# EAGLE design plytka (EAGLE 6.3)
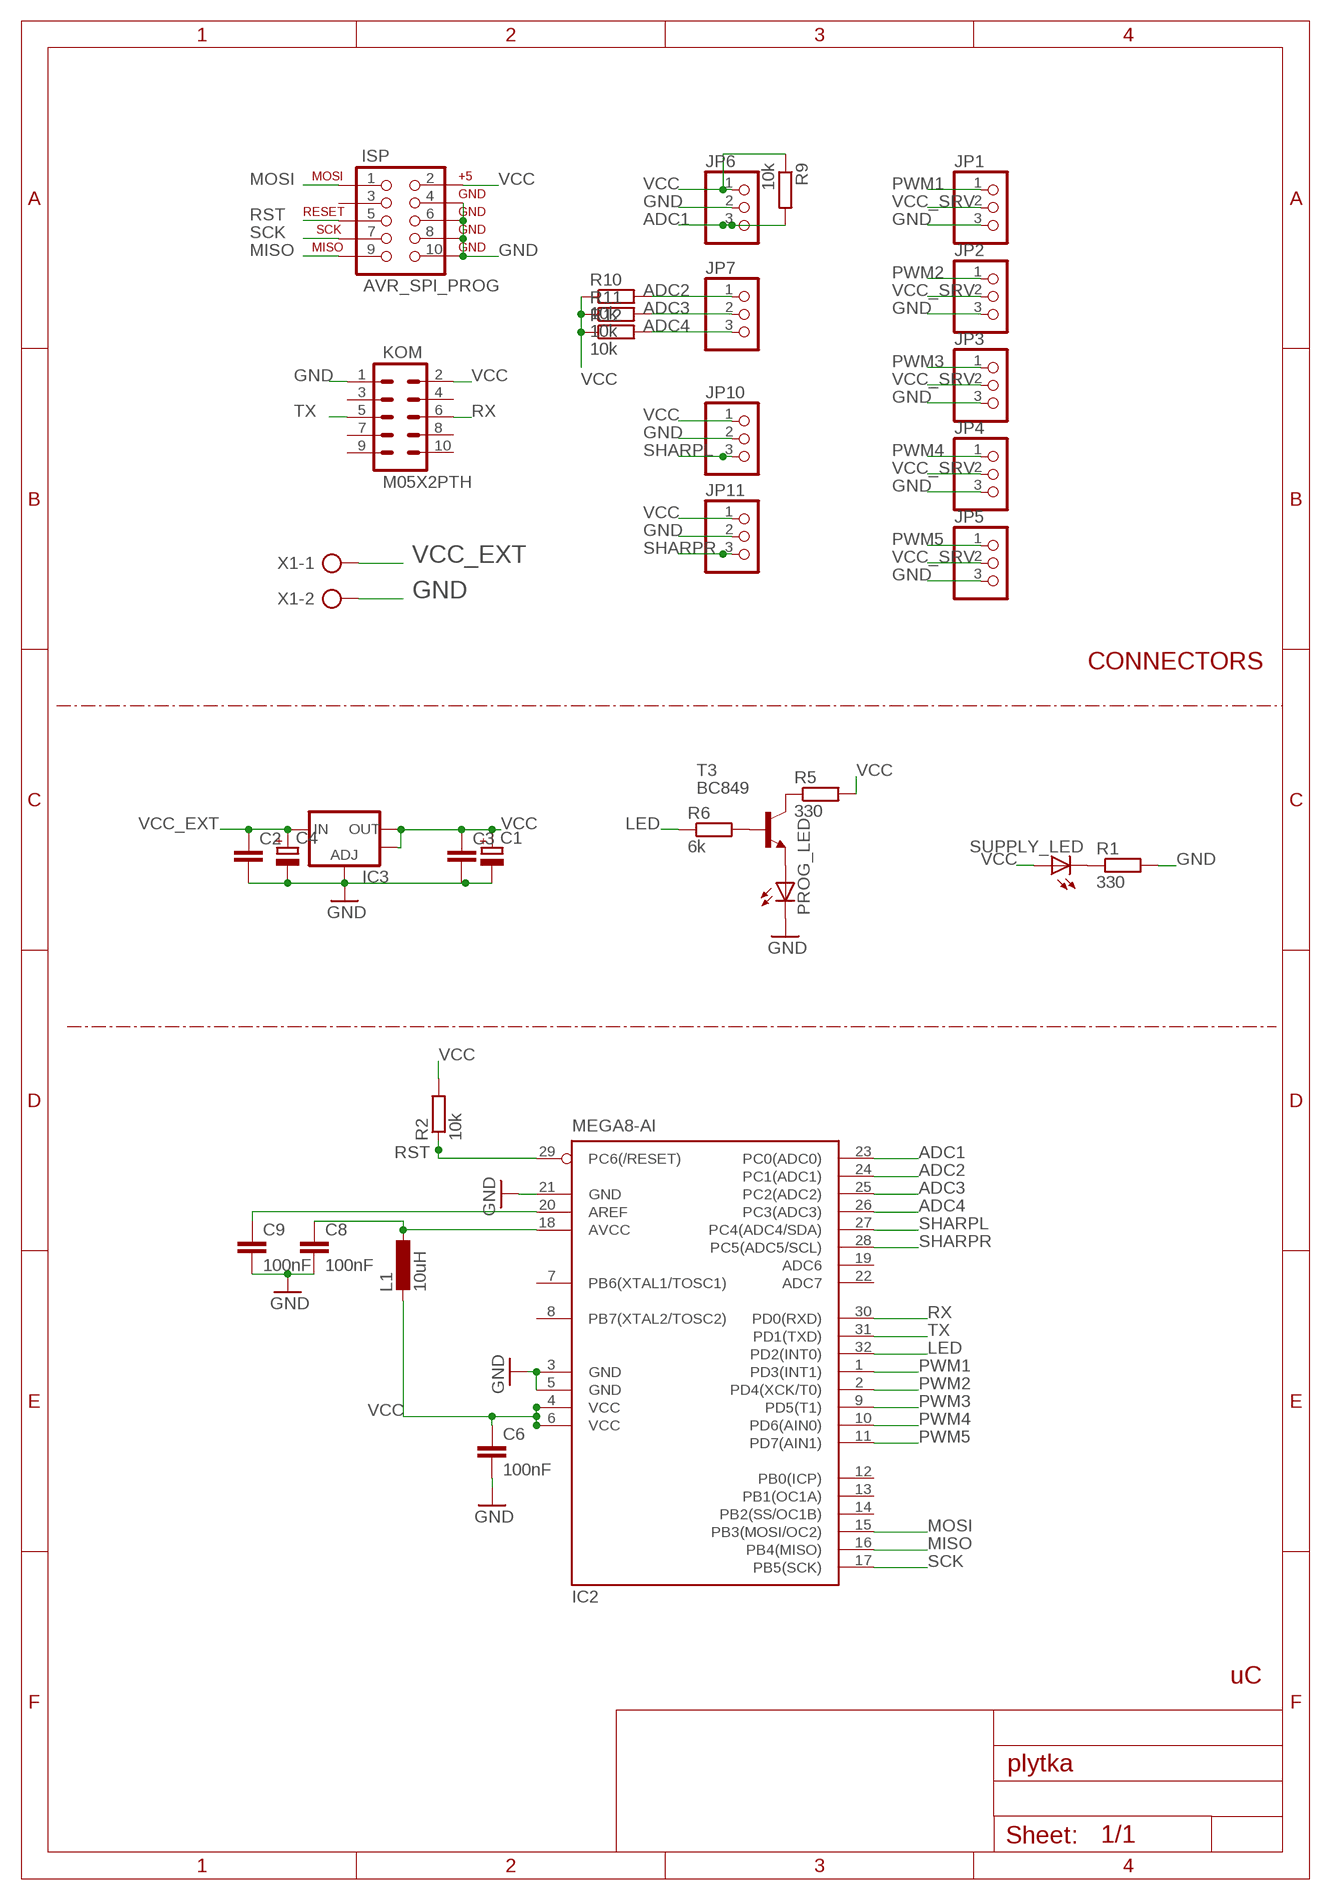
[diagram p0: schematic, sheet 1]

## Parts
C1  CPOL-EUE5-10.5  [E5-10,5]
C2  C-EUC0805  [C0805]
C3  C-EUC0805  [C0805]
C4  CPOL-EUE5-10.5  [E5-10,5]
C6  100nF  C-EUC0805  [C0805]
C8  100nF  C-EUC0805  [C0805]
C9  100nF  C-EUC0805  [C0805]
IC2  MEGA8-AI  [TQFP32-08]
IC3  V_REG_LM1117SOT223  [SOT223]
ISP  AVR_SPI_PROG  [AVR_ICSP]
JP1  PINHD-1X3  [1X03]
JP2  PINHD-1X3  [1X03]
JP3  PINHD-1X3  [1X03]
JP4  PINHD-1X3  [1X03]
JP5  PINHD-1X3  [1X03]
JP6  PINHD-1X3  [1X03]
JP7  PINHD-1X3  [1X03]
JP10  PINHD-1X3  [1X03]
JP11  PINHD-1X3  [1X03]
KOM  M05X2PTH  [AVR_ICSP]
L1  10uH  L-EUL2012C  [L2012C]
PROG_LED  LEDCHIPLED_0805  [CHIPLED_0805]
R1  330  R-EU_R0805  [R0805]
R2  10k  R-EU_M0805  [M0805]
R5  330  R-EU_R0805  [R0805]
R6  6k  R-EU_R0805  [R0805]
R9  10k  R-EU_M0805  [M0805]
R10  10k  R-EU_M0805  [M0805]
R11  10k  R-EU_M0805  [M0805]
R12  10k  R-EU_M0805  [M0805]
SUPPLY_LED  LEDCHIPLED_0805  [CHIPLED_0805]
T3  BC849  [SOT23]
X1  AK300/2  [AK300/2]

## Nets
ADC1: IC2.23(PC0(ADC0)) JP6.3 R9.2
ADC2: IC2.24(PC1(ADC1)) JP7.1 R10.2
ADC3: IC2.25(PC2(ADC2)) JP7.2 R11.2
ADC4: IC2.26(PC3(ADC3)) JP7.3 R12.2
GND: C1.- C2.2 C3.2 C4.- C6.2 C8.2 C9.2 IC2.3(GND) IC2.5(GND) IC2.21(GND) IC3.1(ADJ) ISP.4 ISP.6 ISP.8 ISP.10 JP1.3 JP2.3 JP3.3 JP4.3 JP5.3 JP6.2 JP10.2 JP11.2 KOM.1 PROG_LED.C R1.2 X1.2
LED: IC2.32(PD2(INT0)) R6.1
MISO: IC2.16(PB4(MISO)) ISP.9
MOSI: IC2.15(PB3(MOSI/OC2)) ISP.1
N$1: R1.1 SUPPLY_LED.C
N$4: C9.1 IC2.20(AREF)
N$11: PROG_LED.A T3.2(E)
N$12: R6.2 T3.1(B)
N$13: R5.1 T3.3(C)
N$14: C8.1 IC2.18(AVCC) L1.1
PWM1: IC2.1(PD3(INT1)) JP1.1
PWM2: IC2.2(PD4(XCK/T0)) JP2.1
PWM3: IC2.9(PD5(T1)) JP3.1
PWM4: IC2.10(PD6(AIN0)) JP4.1
PWM5: IC2.11(PD7(AIN1)) JP5.1
RST: IC2.29(PC6(/RESET)) ISP.5 R2.1
RX: IC2.30(PD0(RXD)) KOM.6
SCK: IC2.17(PB5(SCK)) ISP.7
SHARPL: IC2.27(PC4(ADC4/SDA)) JP10.3
SHARPR: IC2.28(PC5(ADC5/SCL)) JP11.3
TX: IC2.31(PD1(TXD)) KOM.5
VCC: C1.+ C3.1 C6.1 IC2.4(VCC) IC2.6(VCC) IC3.2(OUT) IC3.4(OUT) ISP.2 JP6.1 JP10.1 JP11.1 KOM.2 L1.2 R2.2 R5.2 R9.1 R10.1 R11.1 R12.1 SUPPLY_LED.A
VCC_EXT: C2.1 C4.+ IC3.3(IN) X1.1
VCC_SRV: JP1.2 JP2.2 JP3.2 JP4.2 JP5.2
Unconnected: IC2.7(PB6(XTAL1/TOSC1)) IC2.8(PB7(XTAL2/TOSC2)) IC2.12(PB0(ICP)) IC2.13(PB1(OC1A)) IC2.14(PB2(SS/OC1B)) IC2.19(ADC6) IC2.22(ADC7) ISP.3 KOM.3 KOM.4 KOM.7 KOM.8 KOM.9 KOM.10

## Notes on the sheet
- CONNECTORS
- uC

## Library data of the parts
C1 C4 = rcl:CPOL-EU: POLARIZED CAPACITOR, European symbol
C2 C3 C6 C8 C9 = rcl:C-EU: CAPACITOR, European symbol
IC2 = atmel:MEGA8: MICROCONTROLLER 8 Kbytes FLASH, 1 kbytes SRAM, 512 bytes EEPROM, USART, 6-channel 10 bit ADC, 2-channel 8 bit ADC Pin compatible with Atmega48, ATMega88, ATMega168 Source: avr.lbr
IC3 = SparkFun-PowerIC:V_REG_LM1117: Voltage Regulator LM1117 Standard adjustable voltage regulator but in SMD form. Spark Fun Electronics SKU : COM-00595
ISP = SparkFun-Connectors:AVR_SPI_PROG: AVR 10-pin ICSP Header This is the standard AVR In Circuit Serial Programming header. Minimal, but includes pin one indicator. Works with standard Olimex programmers. Also look for the 6-pin reduced version. Spark Fun Electronics SKU: PRT-00778
JP1-JP7 JP10 JP11 = pinhead:PINHD-1X3: PIN HEADER
KOM = SparkFun-Connectors:M05X2: Header 5x2 Standard 10-pin dual row 0.1" header. Commonly used with AVR-ISP. Use with Spark Fun Electronics SKU: PRT-00778
L1 = rcl:L-EU: INDUCTOR, European symbol
PROG_LED SUPPLY_LED = led:LED: LED OSRAM: - CHIPLED LG R971, LG N971, LY N971, LG Q971, LY Q971, LO R971, LY R971 LH N974, LH R974 LS Q976, LO Q976, LY Q976 LO Q996 - Hyper CHIPLED LW Q18S LB Q993, LB Q99A, LB R99A - SideLED LS A670, LO A670, LY A670, LG A670, LP A670 LB A673, LV A673, LT A673, LW A673 LH A674 LY A675 LS A676, LA A676, LO A676, LY A676, LW A676 LS A679, LY A679, LG A679 - Hyper Micro SIDELED® LS Y876, LA Y876, LO Y876, LY Y876 LT Y87S - SmartLED LW L88C, LW L88S LB L89C, LB L89S, LG L890 LS L89K, LO L89K, LY L89K LS L896, LA L896, LO L896, LY L896 - TOPLED LS T670, LO T670, LY T670, LG T670, LP T670 LSG T670, LSP T670, LSY T670, LOP T670, LYG T670 LG T671, LOG T671, LSG T671 LB T673, LV T673, LT T673, LW T673 LH T674 LS T676, LA T676, LO T676, LY T676, LB T676, LH T676, LSB T676, LW T676 LB T67C, LV T67C, LT T67C, LS T67K, LO T67K, LY T67K, LW E67C LS E67B, LA E67B, LO E67B, LY E67B, LB E67C, LV E67C, LT E67C LW T67C LS T679, LY T679, LG T679 LS T770, LO T770, LY T770, LG T770, LP T770 LB T773, LV T773, LT T773, LW T773 LH T774 LS E675, LA E675, LY E675, LS T675 LS T776, LA T776, LO T776, LY T776, LB T776 LHGB T686 LT T68C, LB T68C - Hyper Mini TOPLED® LB M676 - Mini TOPLED Santana® LG M470 LS M47K, LO M47K, LY M47K Source: http://www.osram.convergy.de LUXEON: - LUMILED® LXK2-PW12-R00, LXK2-PW12-S00, LXK2-PW14-U00, LXK2-PW14-V00 LXK2-PM12-R00, LXK2-PM12-S00, LXK2-PM14-U00 LXK2-PE12-Q00, LXK2-PE12-R00, LXK2-PE12-S00, LXK2-PE14-T00, LXK2-PE14-U00 LXK2-PB12-K00, LXK2-PB12-L00, LXK2-PB12-M00, LXK2-PB14-N00, LXK2-PB14-P00, LXK2-PB14-Q00 LXK2-PR12-L00, LXK2-PR12-M00, LXK2-PR14-Q00, LXK2-PR14-R00 LXK2-PD12-Q00, LXK2-PD12-R00, LXK2-PD12-S00 LXK2-PH12-R00, LXK2-PH12-S00 LXK2-PL12-P00, LXK2-PL12-Q00, LXK2-PL12-R00 Source: www.luxeon.com KINGBRIGHT: KA-3528ASYC Source: www.kingbright.com
R1 R2 R5 R6 R9-R12 = rcl:R-EU_: RESISTOR, European symbol
T3 = transistor:BC849: NPN TRANSISTOR
X1 = con-ptr500:AK300/2: CONNECTOR; OC_FARNELL: unknown; OC_NEWARK: unknown

## Board
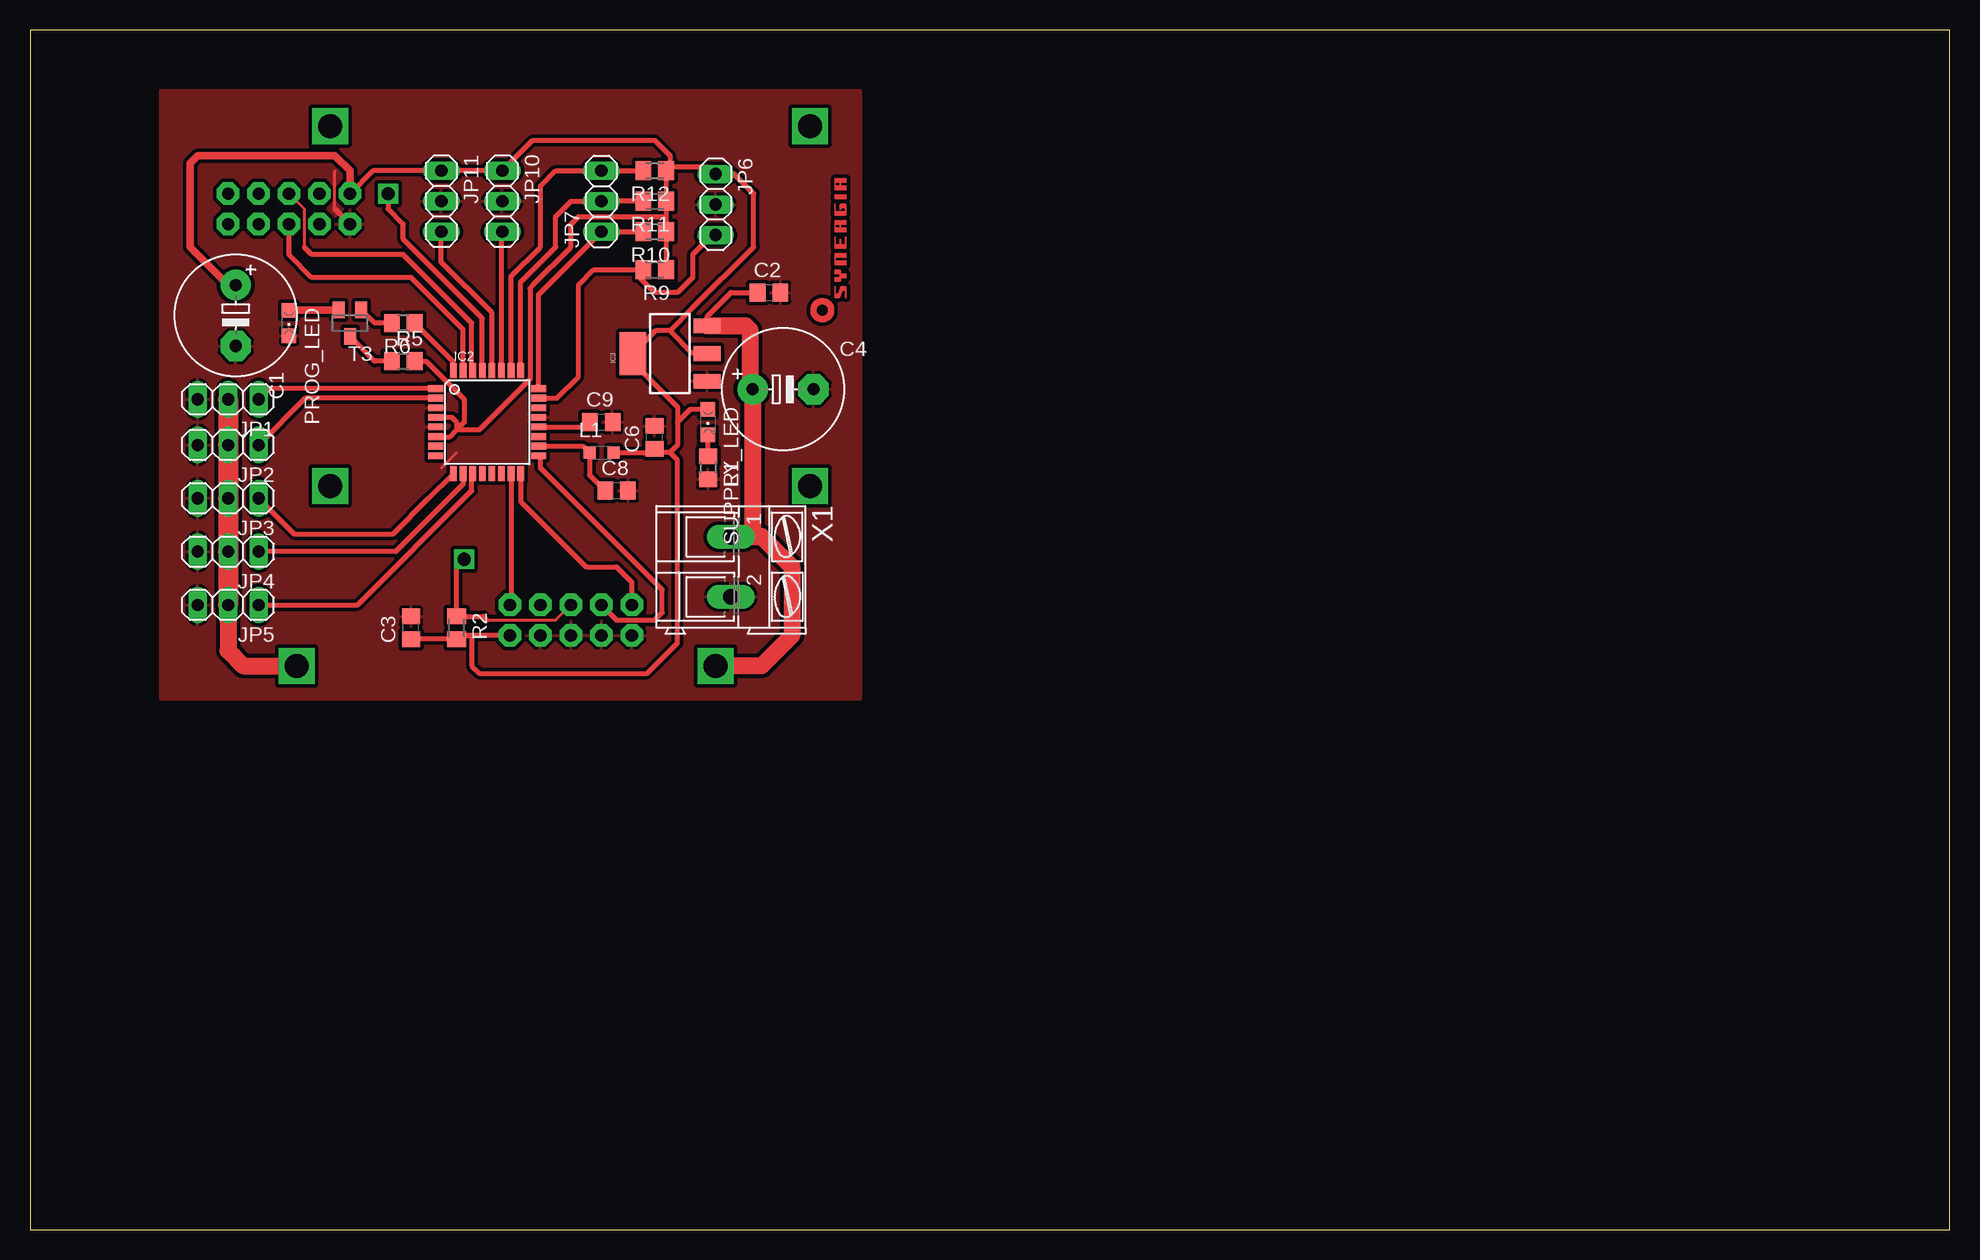
[diagram p1: board, top side]
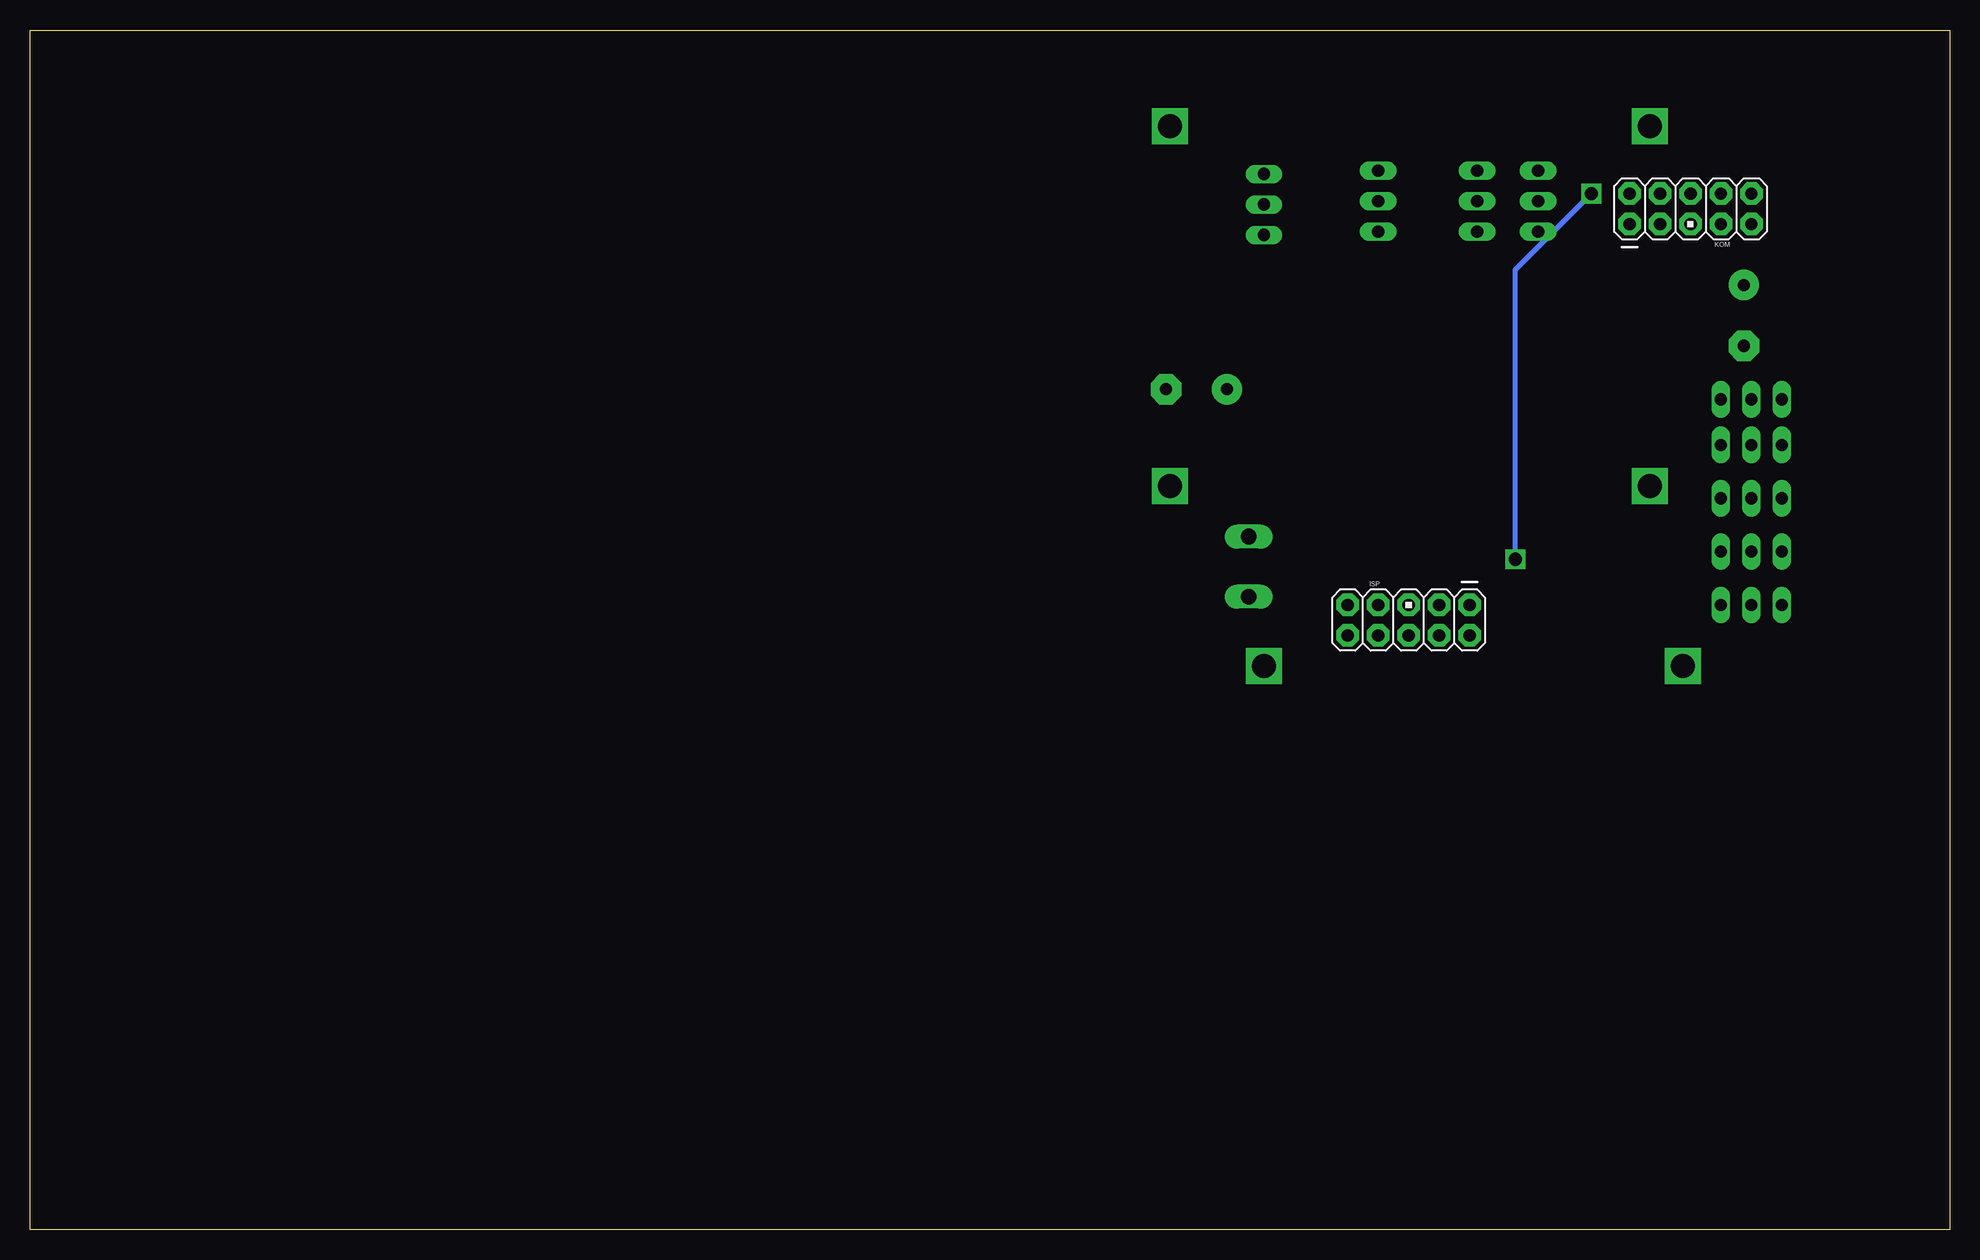
[diagram p2: board, bottom side, seen from below]

Size 160 x 100 mm. Coordinates in mm from the lower left corner, seen from the top.
Outline: 0,0 160,0 160,100 0,100 0,0
Copper layers (1*16): Top 0.035mm / dielectric 1.5mm / Bottom 0.035mm
Design rules "default": minimum track width 10mil, minimum drill 24mil, track to track 8mil, track to pad 8mil, pad to pad 8mil, via to via 8mil, smd to smd 8mil, copper to edge 40mil, drill to drill 8mil, minimum pad ring 10mil, minimum via ring 8mil, stop-mask expansion 4mil, vias tented up to drill 0mil, thermal gap 10mil

### Footprints (pad centres in the part's own frame; a part is rotated, then mirrored left to right if it is on the bottom)
E5-10,5 = drill 1.016 pad 2.54: + -2.54,0 | drill 1.016 pad 2.54 octagon: - 2.54,0
C0805 = smd 1.3 x 1.5: 1 -0.95,0; 2 0.95,0
TQFP32-08 = smd 1.27 x 0.559: 1 -4.293,2.8; 2 -4.293,2; 3 -4.293,1.2; 4 -4.293,0.4; 5 -4.293,-0.4; 6 -4.293,-1.2; 7 -4.293,-2; 8 -4.293,-2.8; 17 4.293,-2.8; 18 4.293,-2; 19 4.293,-1.2; 20 4.293,-0.4; 21 4.293,0.4; 22 4.293,1.2; 23 4.293,2; 24 4.293,2.8 | smd 0.559 x 1.27: 9 -2.8,-4.293; 10 -2,-4.293; 11 -1.2,-4.293; 12 -0.4,-4.293; 13 0.4,-4.293; 14 1.2,-4.293; 15 2,-4.293; 16 2.8,-4.293; 25 2.8,4.293; 26 2,4.293; 27 1.2,4.293; 28 0.4,4.293; 29 -0.4,4.293; 30 -1.2,4.293; 31 -2,4.293; 32 -2.8,4.293
SOT223 = smd 1.219 x 2.235: 1 -2.311,-3.099; 2 0,-3.099; 3 2.311,-3.099 | smd 3.6 x 2.2: 4 0,3.099
AVR_ICSP = drill 1.016 pad 1.88 octagon: 1 -1.27,5.08; 2 1.27,5.08; 3 -1.27,2.54; 4 1.27,2.54; 5 -1.27,0; 6 1.27,0; 7 -1.27,-2.54; 8 1.27,-2.54; 9 -1.27,-5.08; 10 1.27,-5.08
1X03 = drill 1.016 long: 1 -2.54,0; 2 0,0; 3 2.54,0
L2012C = smd 1 x 1: 1 -1,0; 2 1,0
CHIPLED_0805 = smd 1.2 x 1.2: A 0,-1.05; C 0,1.05
R0805 = smd 1.3 x 1.5: 1 -0.95,0; 2 0.95,0
M0805 = smd 1.3 x 1.6: 1 -0.95,0; 2 0.95,0
SOT23 = smd 1 x 1.4: 1 -0.95,-1.1; 2 0.95,-1.1; 3 0,1.1
AK300/2 = drill 1.321 long: 1 -2.515,0; 2 2.489,0

### Placement (x,y rotation side)
C1  17.14,76.2 270 top
C2  61.59,78.11 0 top
C3  31.75,50.16 90 top
C4  62.77,70.06 0 top
C6  52.07,66.04 90 top
C8  48.9,61.59 0 top
C9  47.62,67.31 0 top
IC2  38.1,67.31 0 top
IC3  53.34,73.03 90 top
ISP  45.09,50.8 270 bottom
JP1  16.51,69.22 180 top
JP2  16.51,65.41 180 top
JP3  16.51,60.96 180 top
JP4  16.51,56.52 180 top
JP5  16.51,52.07 180 top
JP6  57.15,85.45 270 top
JP7  47.62,85.72 90 top
JP10  39.37,85.72 270 top
JP11  34.29,85.72 270 top
KOM  21.59,85.09 90 bottom
L1  47.62,64.77 0 top
PROG_LED  21.59,75.56 180 top
R1  56.52,63.5 270 top
R2  35.56,50.16 270 top
R5  31.11,72.39 0 top
R6  31.11,75.56 180 top
R9  52.07,80.01 180 top
R10  52.07,83.19 180 top
R11  52.07,85.72 180 top
R12  52.07,88.27 180 top
SUPPLY_LED  56.52,67.31 180 top
T3  26.67,75.56 180 top
U$1  [SYNERGIA_12MM]  68.04,75.64 90 top
X1  58.42,55.24 270 top

### Tracks (layer width: path | path; a pad name or v marks a point on that pad's centre or on a via)
ADC1
  Top 0.406: IC2.23 43.91,69.31 45.72,71.12 45.72,78.74 46.99,80.01 R9.2 50.8,79.69 50.8,79.38 52.07,78.11 53.98,78.11 55.24,79.38 55.24,81.28 56.52,82.55 JP6.3
ADC2
  Top 0.406: IC2.24 42.39,77.95 JP7.1 R10.2
ADC3
  Top 0.406: IC2.25 40.9,79 43.81,81.92 43.81,84.45 45.09,85.72 JP7.2 R11.2
ADC4
  Top 0.406: IC2.26 40.1,79.47 42.55,81.92 42.55,87 43.81,88.27 JP7.3 | JP7.3 48.26,88.27 | 48.26,88.27 JP7.3 | 48.26,88.27 R12.2
GND
  Top 0.254: 25.4,85.09 25.4,88.27 | 34.29,63.5 35.56,64.77
  Top 0.406: KOM.1 25.4,85.09
  pour Top (isolate 0.305): 10.89,44.18 10.89,94.98 69.22,94.98 69.22,44.18
LED
  Top 0.406: IC2.32 35.3,72.33 R6.1
MISO
  Top 0.406: IC2.16 40.9,60.7 46.35,55.24 48.9,55.24 50.16,53.98 ISP.9
MOSI
  Top 0.406: IC2.15 40.1,52.16 ISP.1
N$1
  Top 0.406: R1.1 SUPPLY_LED.C
N$2  (via drill 2)
  other vias: 25,62
N$3  (via drill 2)
  other vias: 65,62
N$4
  Top 0.406: IC2.20 46.27,66.91 C9.1
N$5  (via drill 2)
  other vias: 25,92
N$6  (via drill 2)
  other vias: 65,92
N$11
  Top 0.61: T3.2 21.64,76.67 PROG_LED.A
N$12
  Top 0.406: R6.2 28.72,75.56 T3.1
N$13
  Top 0.406: R5.1 28.75,72.39 T3.3
N$14
  Top 0.406: IC2.18 46.09,65.31 L1.1 46.62,62.91 C8.1
PWM1
  Top 0.406: IC2.1 19.95,70.11 JP1.1
PWM2
  Top 0.406: IC2.2 22.95,69.31 JP2.1
PWM3
  Top 0.406: IC2.9 33.24,60.96 30.28,58 22,58 JP3.1
PWM4
  Top 0.406: IC2.10 36.1,62.13 30.48,56.52 JP4.1
PWM5
  Top 0.406: JP5.1 27.3,52.07 36.83,61.59 36.83,62.95 IC2.11
RST  (via drill 1.1)
  Top 0.254: 38.1,50.8 43.81,50.8 ISP.5
  Top 0.406: IC2.29 37.7,75.97 31.11,82.55 31.11,83.82 29.84,85.09 v29.84,86.36 | v36.2,55.88 35.56,55.24 R2.1 37.78,51.12 38.1,50.8
  Bottom 0.406: v36.2,55.88 36.2,80.01 v29.84,86.36
RX
  Top 0.254: KOM.6 22.86,85.09 22.86,81.92
  Top 0.406: IC2.30 36.83,71.67 36.83,75.56 31.11,81.28 23.5,81.28 22.86,81.92
SCK
  Top 0.406: ISP.7 48.9,50.8 52.07,50.8 52.7,51.44 52.7,53.34 42.55,63.5 42.55,64.36 IC2.17
SHARPL
  Top 0.406: IC2.27 39.3,83.11 JP10.3
SHARPR
  Top 0.406: IC2.28 38.5,76.44 34.29,80.64 34.29,82.55 JP11.3
TX
  Top 0.406: IC2.31 36.1,74.39 36.1,75.03 31.75,79.38 23.5,79.38 21.59,81.28 KOM.5
VCC
  Top 0.406: 53.02,84.45 R11.1 R12.1 53.34,88.58 | 53.02,84.45 R10.1 R9.1 | 53.34,88.58 53.34,89.53 52.07,90.81 41.91,90.81 JP10.1 JP11.1 28.57,88.27 KOM.2 | L1.2 51.75,64.77 C6.1 52.39,64.77 53.34,64.77 | 53.98,67.31 53.98,68.58 50.24,72.31 IC3.4 52.15,74.93 53.34,74.93 | 53.98,67.31 53.98,65.41 53.34,64.77 | ISP.2 36.83,49.53 | 36.83,49.53 35.88,49.53 | 35.88,49.53 R2.2 C3.1 | 35.88,49.53 36.83,49.53 | IC2.4 35.16,67.71 35.56,67.31 35.56,66.67 | 35.56,66.67 34.92,66.04 33.88,66.04 IC2.6 | 35.56,66.67 37.47,66.67 41.67,70.89 41.67,78.48 41.91,78.71 41.91,78.74 45.09,81.92 45.09,83.82 45.72,84.45 53.02,84.45 | IC3.2 55.24,73.03 53.34,74.93 | 36.83,49.53 36.83,46.99 37.47,46.35 51.44,46.35 53.98,48.9 53.98,64.14 53.34,64.77 | R5.2 33.02,72.39 36.2,69.22 36.2,67.31 35.56,66.67 | SUPPLY_LED.A 55.02,68.36 53.98,67.31 | 53.34,74.93 55.24,76.83 60.33,81.92 60.33,86.36 59.69,87 58.69,88 JP6.1 56.56,88.58 53.34,88.58
  Top 0.61: C1.+ 16.51,78.74 13.34,81.92 13.34,88.9 13.97,89.53 25.4,89.53 26.67,88.27 KOM.2
VCC_EXT  (via drill 2)
  Top 0.406: IC3.3 56.44,76.12 58.42,78.11 C2.1 | C2.1 60.96,78.11 C2.1
  Top 1.422: X1.1 58.42,57.78 60,57.78 | 60,57.78 60.96,57.78 63.5,55.24 63.5,49.53 60.96,46.99 v57.15,46.99 | IC3.3 59.66,75.34 60,75 60,70.28 C4.+ 60.23,61.23 60.23,58.02 60,57.78
VCC_SRV  (via drill 2 pad 1.93)
  Top 1.422: JP5.2 16.51,48.26 17.78,46.99 v22.23,46.99
  Top 1.676: JP1.2 JP2.2 JP3.2 JP4.2 JP5.2